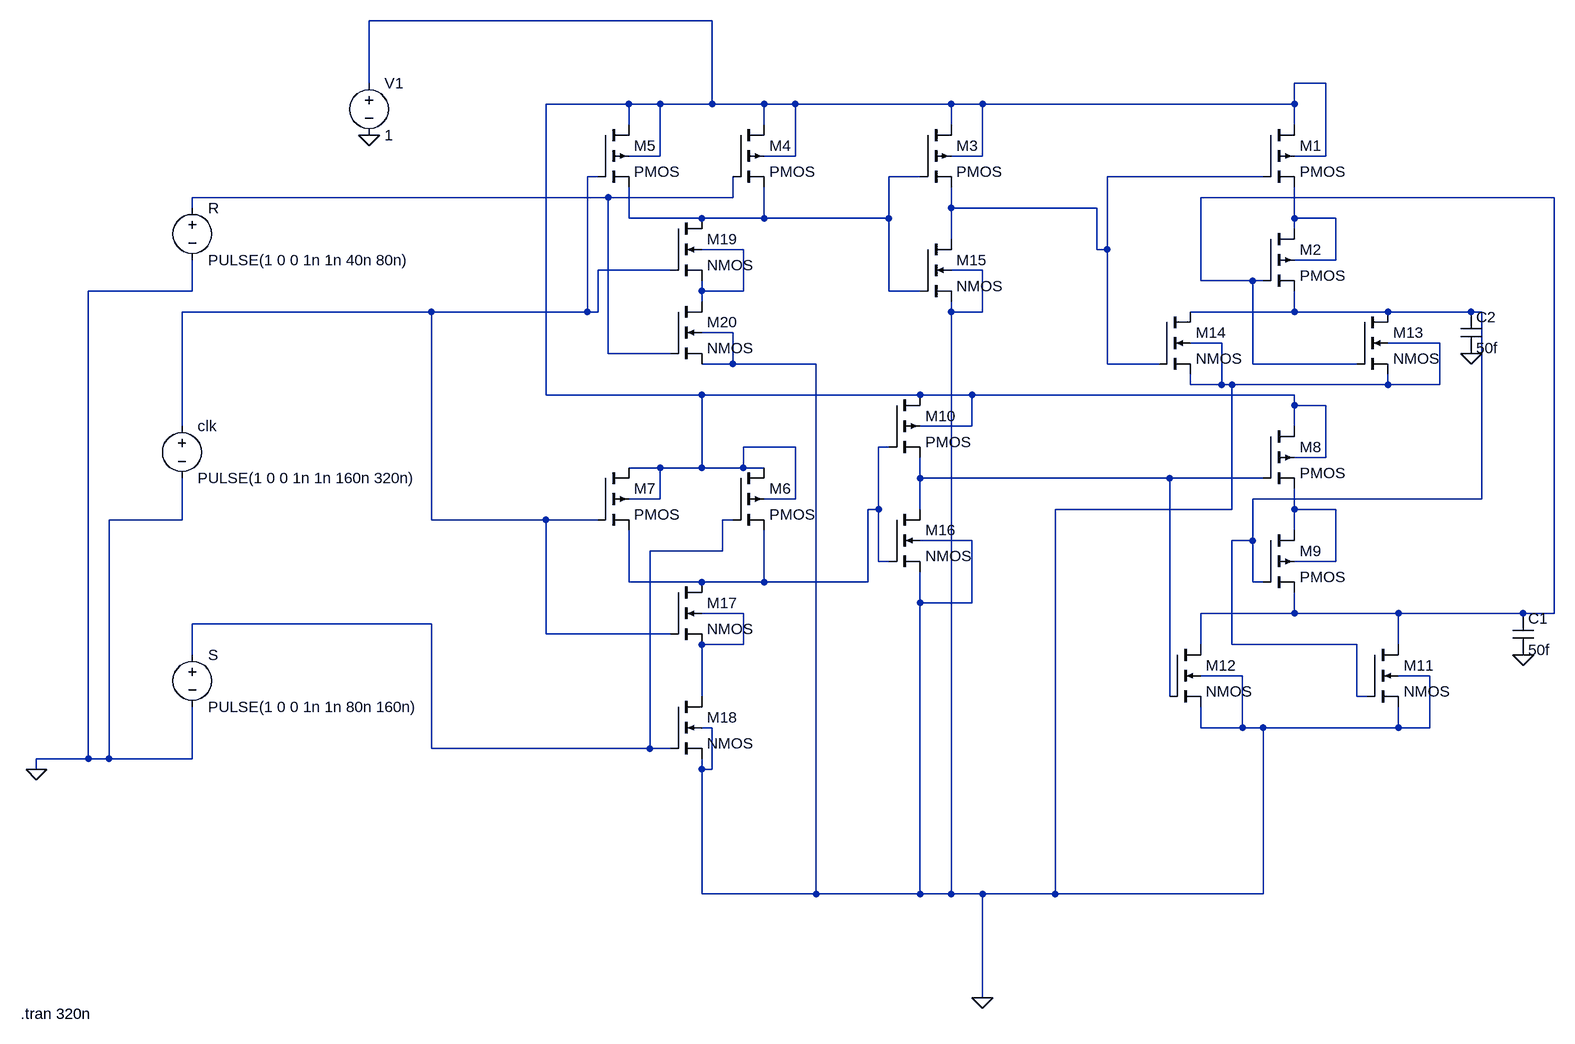
[diagram p0: schematic randomCOMBINATIONALcircuit.asc]
randomCOMBINATIONALcircuit.asc, the LTspice schematic file:
Version 4
SHEET 1 880 1416
WIRE -592 -128 -1120 -128
WIRE -1120 -32 -1120 -128
WIRE 352 -32 304 -32
WIRE -720 0 -848 0
WIRE -672 0 -720 0
WIRE -592 0 -592 -128
WIRE -592 0 -672 0
WIRE -512 0 -592 0
WIRE -464 0 -512 0
WIRE -224 0 -464 0
WIRE -176 0 -224 0
WIRE 304 0 304 -32
WIRE 304 0 -176 0
WIRE -720 32 -720 0
WIRE -512 32 -512 0
WIRE -224 32 -224 0
WIRE 304 32 304 0
WIRE -672 80 -672 0
WIRE -672 80 -720 80
WIRE -464 80 -464 0
WIRE -464 80 -512 80
WIRE -176 80 -176 0
WIRE -176 80 -224 80
WIRE 352 80 352 -32
WIRE 352 80 304 80
WIRE -768 112 -784 112
WIRE -272 112 -320 112
WIRE 256 112 16 112
WIRE -752 144 -1392 144
WIRE -560 144 -560 112
WIRE -560 144 -752 144
WIRE 704 144 160 144
WIRE -1392 160 -1392 144
WIRE -224 160 -224 128
WIRE 0 160 -224 160
WIRE -720 176 -720 128
WIRE -608 176 -720 176
WIRE -512 176 -512 128
WIRE -512 176 -608 176
WIRE -320 176 -320 112
WIRE -320 176 -512 176
WIRE 304 176 304 128
WIRE 368 176 304 176
WIRE 304 192 304 176
WIRE -224 208 -224 160
WIRE -544 224 -608 224
WIRE 0 224 0 160
WIRE 16 224 16 112
WIRE 16 224 0 224
WIRE 368 240 368 176
WIRE 368 240 304 240
WIRE -656 256 -768 256
WIRE -176 256 -224 256
WIRE 160 272 160 144
WIRE 240 272 160 272
WIRE 256 272 240 272
WIRE -1392 288 -1392 240
WIRE -1392 288 -1552 288
WIRE -608 288 -608 272
WIRE -544 288 -544 224
WIRE -544 288 -608 288
WIRE -320 288 -320 176
WIRE -272 288 -320 288
WIRE -608 304 -608 288
WIRE -1024 320 -1408 320
WIRE -784 320 -784 112
WIRE -784 320 -1024 320
WIRE -768 320 -768 256
WIRE -768 320 -784 320
WIRE -224 320 -224 304
WIRE -176 320 -176 256
WIRE -176 320 -224 320
WIRE 304 320 304 288
WIRE 304 320 144 320
WIRE 448 320 304 320
WIRE 576 320 448 320
WIRE 592 320 576 320
WIRE -560 352 -608 352
WIRE 192 368 144 368
WIRE 528 368 448 368
WIRE -752 384 -752 144
WIRE -656 384 -752 384
WIRE -560 400 -560 352
WIRE -560 400 -608 400
WIRE -432 400 -560 400
WIRE 16 400 16 224
WIRE 96 400 16 400
WIRE 240 400 240 272
WIRE 400 400 240 400
WIRE 144 432 144 416
WIRE 192 432 192 368
WIRE 192 432 144 432
WIRE 208 432 192 432
WIRE 448 432 448 416
WIRE 448 432 208 432
WIRE 528 432 528 368
WIRE 528 432 448 432
WIRE -848 448 -848 0
WIRE -608 448 -848 448
WIRE -272 448 -608 448
WIRE -192 448 -272 448
WIRE 304 448 -192 448
WIRE 304 464 304 448
WIRE 352 464 304 464
WIRE -1408 496 -1408 320
WIRE -192 496 -192 448
WIRE -192 496 -272 496
WIRE 304 496 304 464
WIRE -464 528 -544 528
WIRE -320 528 -336 528
WIRE 352 544 352 464
WIRE 352 544 304 544
WIRE -672 560 -720 560
WIRE -608 560 -608 448
WIRE -608 560 -672 560
WIRE -544 560 -544 528
WIRE -544 560 -608 560
WIRE -512 560 -544 560
WIRE -272 576 -272 544
WIRE 112 576 -272 576
WIRE 256 576 112 576
WIRE -672 608 -672 560
WIRE -672 608 -720 608
WIRE -464 608 -464 528
WIRE -464 608 -512 608
WIRE 592 608 592 320
WIRE 592 608 240 608
WIRE -336 624 -336 528
WIRE -336 624 -352 624
WIRE -272 624 -272 576
WIRE 208 624 208 432
WIRE 208 624 -64 624
WIRE 304 624 304 592
WIRE 368 624 304 624
WIRE -1408 640 -1408 576
WIRE -1408 640 -1520 640
WIRE -1024 640 -1024 320
WIRE -848 640 -1024 640
WIRE -768 640 -848 640
WIRE -560 640 -576 640
WIRE 304 656 304 624
WIRE -192 672 -272 672
WIRE 240 672 240 608
WIRE 240 672 208 672
WIRE -576 688 -576 640
WIRE -576 688 -688 688
WIRE -336 704 -336 624
WIRE -320 704 -336 704
WIRE 368 704 368 624
WIRE 368 704 304 704
WIRE -720 736 -720 656
WIRE -608 736 -720 736
WIRE -512 736 -512 656
WIRE -512 736 -608 736
WIRE -352 736 -352 624
WIRE -352 736 -512 736
WIRE 240 736 240 672
WIRE 256 736 240 736
WIRE -272 768 -272 720
WIRE -192 768 -192 672
WIRE -192 768 -272 768
WIRE -544 784 -608 784
WIRE 304 784 304 752
WIRE 304 784 160 784
WIRE 464 784 304 784
WIRE 656 784 464 784
WIRE 704 784 704 144
WIRE 704 784 656 784
WIRE -1024 800 -1392 800
WIRE -848 816 -848 640
WIRE -656 816 -848 816
WIRE -544 832 -544 784
WIRE -544 832 -608 832
WIRE 160 832 160 784
WIRE 208 832 208 672
WIRE 400 832 208 832
WIRE 464 832 464 784
WIRE -1392 848 -1392 800
WIRE 224 880 160 880
WIRE 512 880 464 880
WIRE -608 912 -608 832
WIRE 112 912 112 576
WIRE 400 912 400 832
WIRE 416 912 400 912
WIRE -592 960 -608 960
WIRE 160 960 160 928
WIRE 224 960 224 880
WIRE 224 960 160 960
WIRE 256 960 224 960
WIRE 464 960 464 928
WIRE 464 960 256 960
WIRE 512 960 512 880
WIRE 512 960 464 960
WIRE -1024 992 -1024 800
WIRE -688 992 -688 688
WIRE -688 992 -1024 992
WIRE -656 992 -688 992
WIRE -1552 1008 -1552 288
WIRE -1552 1008 -1632 1008
WIRE -1520 1008 -1520 640
WIRE -1520 1008 -1552 1008
WIRE -1392 1008 -1392 928
WIRE -1392 1008 -1520 1008
WIRE -1632 1024 -1632 1008
WIRE -608 1024 -608 1008
WIRE -592 1024 -592 960
WIRE -592 1024 -608 1024
WIRE -608 1216 -608 1024
WIRE -432 1216 -432 400
WIRE -432 1216 -608 1216
WIRE -272 1216 -272 768
WIRE -272 1216 -432 1216
WIRE -224 1216 -224 320
WIRE -224 1216 -272 1216
WIRE -176 1216 -224 1216
WIRE -64 1216 -64 624
WIRE -64 1216 -176 1216
WIRE 256 1216 256 960
WIRE 256 1216 -64 1216
WIRE -176 1376 -176 1216
FLAG -176 1376 0
FLAG -1632 1024 0
FLAG 576 384 0
FLAG 656 848 0
FLAG -1120 48 0
SYMBOL pmos4 256 32 R0
SYMATTR InstName M1
SYMATTR Value2 l=32n w=64n
SYMBOL pmos4 256 192 R0
SYMATTR InstName M2
SYMATTR Value2 l=32n w=64n
SYMBOL pmos4 -272 32 R0
SYMATTR InstName M3
SYMATTR Value2 l=32n w=64n
SYMBOL pmos4 -560 32 R0
SYMATTR InstName M4
SYMATTR Value2 l=32n w=64n
SYMBOL pmos4 -768 32 R0
SYMATTR InstName M5
SYMATTR Value2 l=32n w=64n
SYMBOL pmos4 -560 560 R0
SYMATTR InstName M6
SYMATTR Value2 l=32n w=64n
SYMBOL pmos4 -768 560 R0
SYMATTR InstName M7
SYMATTR Value2 l=32n w=64n
SYMBOL pmos4 256 496 R0
SYMATTR InstName M8
SYMATTR Value2 l=32n w=64n
SYMBOL pmos4 256 656 R0
SYMATTR InstName M9
SYMATTR Value2 l=32n w=64n
SYMBOL pmos4 -320 448 R0
SYMATTR InstName M10
SYMATTR Value2 l=32n w=64n
SYMBOL nmos4 416 832 R0
SYMATTR InstName M11
SYMATTR Value2 l=32n w=64n
SYMBOL nmos4 112 832 R0
SYMATTR InstName M12
SYMATTR Value2 l=32n w=64n
SYMBOL nmos4 400 320 R0
SYMATTR InstName M13
SYMATTR Value2 l=32n w=64n
SYMBOL nmos4 96 320 R0
SYMATTR InstName M14
SYMATTR Value2 l=32n w=64n
SYMBOL nmos4 -272 208 R0
SYMATTR InstName M15
SYMATTR Value2 l=32n w=64n
SYMBOL nmos4 -320 624 R0
SYMATTR InstName M16
SYMATTR Value2 l=32n w=64n
SYMBOL nmos4 -656 736 R0
SYMATTR InstName M17
SYMBOL nmos4 -656 912 R0
SYMATTR InstName M18
SYMBOL nmos4 -656 176 R0
SYMATTR InstName M19
SYMBOL nmos4 -656 304 R0
SYMATTR InstName M20
SYMBOL voltage -1120 -48 R0
SYMATTR InstName V1
SYMATTR Value 1
SYMBOL voltage -1392 144 R0
WINDOW 123 0 0 Left 0
WINDOW 39 0 0 Left 0
SYMATTR InstName R
SYMATTR Value PULSE(1 0 0 1n 1n 40n 80n)
SYMBOL voltage -1408 480 R0
WINDOW 123 0 0 Left 0
WINDOW 39 0 0 Left 0
SYMATTR InstName clk
SYMATTR Value PULSE(1 0 0 1n 1n 160n 320n)
SYMBOL voltage -1392 832 R0
WINDOW 123 0 0 Left 0
WINDOW 39 0 0 Left 0
SYMATTR InstName S
SYMATTR Value PULSE(1 0 0 1n 1n 80n 160n)
SYMBOL cap 640 784 R0
SYMATTR InstName C1
SYMATTR Value 50f
SYMBOL cap 560 320 R0
SYMATTR InstName C2
SYMATTR Value 50f
TEXT -1656 1400 Left 2 !.tran 320n

The netlist it stands for:
* randomCOMBINATIONALcircuit.asc
M1 N001 N004 N007 N001 PMOS l=32n w=64n
M2 N007 N006 N009 N007 PMOS l=32n w=64n
M3 N001 N003 N004 N001 PMOS l=32n w=64n
M4 N001 N005 N003 N001 PMOS l=32n w=64n
M5 N001 N002 N003 N001 PMOS l=32n w=64n
M6 N001 N013 N010 N001 PMOS l=32n w=64n
M7 N001 N002 N010 N001 PMOS l=32n w=64n
M8 N001 N011 N012 N001 PMOS l=32n w=64n
M9 N012 N009 N006 N012 PMOS l=32n w=64n
M10 N001 N010 N011 N001 PMOS l=32n w=64n
M11 N006 N009 0 0 NMOS l=32n w=64n
M12 N006 N011 0 0 NMOS l=32n w=64n
M13 N009 N006 0 0 NMOS l=32n w=64n
M14 N009 N004 0 0 NMOS l=32n w=64n
M15 N004 N003 0 0 NMOS l=32n w=64n
M16 N011 N010 0 0 NMOS l=32n w=64n
M17 N010 N002 N014 N014 NMOS
M18 N014 N013 0 0 NMOS
M19 N003 N002 N008 N008 NMOS
M20 N008 N005 0 0 NMOS
V1 N001 0 1
V§R N005 0 PULSE(1 0 0 1n 1n 40n 80n)
V§clk N002 0 PULSE(1 0 0 1n 1n 160n 320n)
V§S N013 0 PULSE(1 0 0 1n 1n 80n 160n)
C1 N006 0 50f
C2 N009 0 50f
.model NMOS NMOS
.model PMOS PMOS
.lib standard.mos
.tran 320n
.backanno
.end